# Altium schematic sheet Power.SchDoc
size A3; DocumentNumber: 4; SheetNumber: 4
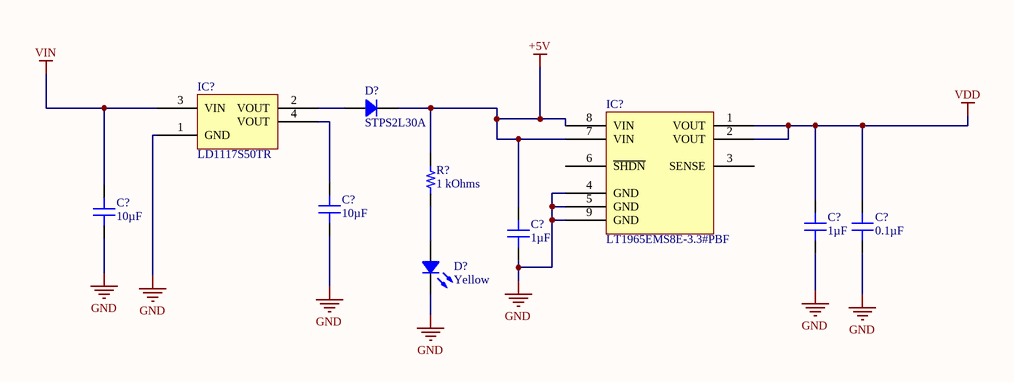
[diagram p0: Power.SchDoc]

## Parts
(Parts that share a designator on the sheet are numbered #1, #2 ... from top to bottom, then left to right.)
C?#1  10µF  [CAP 0603_1608]
C?#2  10µF  [CAP 0603_1608]
C?#3  1µF  [CAP 0603_1608]
C?#4  0.1µF  [CAP 0805_2012]
C?#5  1µF  [CAP 0603_1608]
D?#1  STPS2L30A  [DO214AC SMA]
D?#2  Yellow  [LED 1206_3216 YELLOW]
IC?#1  LD1117S50TR  [ST SOT-223]
IC?#2  LT1965EMS8E-3.3#PBF  [LT MSOP-8 MS8E 3X3MM]
R?  1 kOhms  [RES 0603_1608]

## Nets
+5V: C?#5.1 D?#1.2 IC?#2.7(VIN) IC?#2.8(VIN) R?.2
GND: C?#1.1 C?#2.1 C?#3.2 C?#4.2 C?#5.2 D?#2.2 IC?#1.1(GND) IC?#2.4(GND) IC?#2.5(GND) IC?#2.9(GND)
VDD: C?#3.1 C?#4.1 IC?#2.1(VOUT) IC?#2.2(VOUT)
VIN: C?#2.2 IC?#1.3(VIN)
NetC?#1_2: C?#1.2 IC?#1.4(VOUT)
NetD?#1_1: D?#1.1 IC?#1.2(VOUT)
NetD?#2_1: D?#2.1 R?.1

Not connected (* = marked no-connect by the designer): IC?#2 3(SENSE) 6(~{SHDN})

## Library data of the parts
C?#1 C?#2 = GRM188R61E106MA73D: CAP CER 10UF 25V X5R 0603; Manufacturer: Murata Electronics; Tolerance: ±20%; Part Number: GRM188R61E106MA73D; Value: 10µF; Applications: General Purpose; Capacitance: 10µF; ComponentLink1Description: Datasheet; ComponentLink1URL: https://www.murata.com/~/media/webrenewal/support/library/catalog/products/capacitor/mlcc/c02e.ashx?la=en-us; ComponentLink2Description: DigiKey Link; ComponentLink2URL: http://digikey.com/product-detail/en/murata-electronics/GRM188R61E106MA73D/490-7202-1-ND/3900486; Device Package: 0603 (1608 Metric); LastUpdated: 02/09/2020 01:03:25; Lifecycle Status: Active; Minimum Order: 1; Mounting Type: Surface Mount, MLCC; Operating Temperature: -55°C ~ 85°C; Package / Case: 0603 (1608 Metric); Packaging: TapeAndReel; PartId: 8314; Part Status: Active; Price: 0.09; Series: GRM; Size / Dimension: 0.063" L x 0.031" W (1.60mm x 0.80mm); Supplier 1: DigiKey; Supplier Part Number 1: 490-7202-1-ND; Temperature Coefficient: X5R; Thickness (Max): 0.031" (0.80mm); Voltage - Rated: 25V
C?#3 C?#5 = C0603C105K8PACTU: CAP CER 1UF 10V X5R 0603; Manufacturer: KEMET; Tolerance: ±10%; Part Number: C0603C105K8PACTU; Value: 1µF; Applications: General Purpose; Capacitance: 1µF; ComponentLink1Description: Datasheet; ComponentLink1URL: https://api.kemet.com/component-edge/download/datasheet/C0603C105K8PACTU.pdf; ComponentLink2Description: DigiKey Link; ComponentLink2URL: http://digikey.com/product-detail/en/kemet/C0603C105K8PACTU/399-3118-1-ND/551623; Device Package: 0603 (1608 Metric); LastUpdated: 02/09/2020 01:03:23; Lifecycle Status: Active; Minimum Order: 1; Mounting Type: Surface Mount, MLCC; Operating Temperature: -55°C ~ 85°C; Package / Case: 0603 (1608 Metric); Packaging: TapeAndReel; PartId: 9480; Part Status: Active; Price: 0.01; Series: SMD Comm X5R; Size / Dimension: 0.063" L x 0.031" W (1.60mm x 0.80mm); Supplier 1: DigiKey; Supplier Part Number 1: 399-3118-1-ND; Temperature Coefficient: X5R; Thickness (Max): 0.035" (0.90mm); Voltage - Rated: 10V
C?#4 = AC0805KKX8R9BB104: CAP CER 0805 10% X8R 50V 100NF; Manufacturer: Yageo; Part Number: AC0805KKX8R9BB104; Value: 0.1µF; Applications: Automotive; Capacitance: 0.1µF; ComponentLink1Description: Datasheet; ComponentLink1URL: http://www.yageo.com/documents/recent/AC0805KKX8R9BB104.pdf; ComponentLink2Description: DigiKey Link; ComponentLink2URL: http://digikey.com/product-detail/en/yageo/AC0805KKX8R9BB104/311-4624-1-ND/9699550; Device Package: 0805 (2012 Metric); LastUpdated: 02/09/2020 01:04:20; Lifecycle Status: Active; Minimum Order: 1; Mounting Type: Surface Mount, MLCC; Operating Temperature: -55°C ~ 150°C; Package / Case: 0805 (2012 Metric); Packaging: TapeAndReel; PartId: 14076; Part Status: Active; Price: 0.06; Ratings: AEC-Q200; Series: AC; Size / Dimension: 0.079" L x 0.049" W (2.00mm x 1.25mm); Supplier 1: DigiKey; Supplier Part Number 1: 311-4624-1-ND; Temperature Coefficient: X8R; Thickness (Max): 0.057" (1.45mm); Tolerance: ±10%; Voltage - Rated: 50V
D?#1 = STPS2L30A: DIODE SCHOTTKY 30V 2A SMA; Manufacturer: STMicroelectronics; Current - Reverse Leakage @ Vr: 200µA @ 30V; Speed: Fast Recovery =< 500ns, > 200mA (Io); Voltage - Forward (Vf) (Max) @ If: 450mV @ 2A; Part Number: STPS2L30A; ComponentLink1Description: Datasheet; ComponentLink1URL: http://www.st.com/content/ccc/resource/technical/document/datasheet/62/6b/2e/7f/34/cb/43/55/CD00001633.pdf/files/CD00001633.pdf/jcr:content/translations/en.CD00001633.pdf; ComponentLink2Description: DigiKey Link; ComponentLink2URL: http://digikey.com/product-detail/en/stmicroelectronics/STPS2L30A/497-3759-1-ND/691929; Current - Average Rectified (Io): 2A; Diode Type: Schottky; LastUpdated: 02/09/2020 01:19:04; Lifecycle Status: Active; Minimum Order: 1; Mounting Type: Surface Mount; Operating Temperature - Junction: 150°C (Max); Package / Case: DO-214AC, SMA; Packaging: TapeAndReel; PartId: 1916; Part Status: Active; Price: 0.07; Series: -; Supplier 1: DigiKey; Supplier Part Number 1: 497-3759-1-ND; Supplier Device Package: SMA; Voltage - DC Reverse (Vr) (Max): 30V
D?#2 = 5990240007F: LED YELLOW 1206 SMD; Manufacturer: Dialight; Configuration: Standard; Current - Test: 20mA; Lens Color: 0.80mm; Lens Size: 2.00mm x 1.60mm; Lens Style: Rectangle with Flat Top; Millicandela Rating: 126mcd; Viewing Angle: 140°; Voltage - Forward (Vf) (Typ): 2.1V; Wavelength - Dominant: 590nm; Part Number: 5990240007F; Color: Yellow; ComponentLink1Description: Datasheet; ComponentLink1URL: http://www.dialightsignalsandcomponents.com/Assets/Brochures_And_Catalogs/Indication/CBI_SMD_new/Dialight_CBI_data_599-1206_Apr2018.pdf; ComponentLink2Description: DigiKey Link; ComponentLink2URL: http://digikey.com/product-detail/en/dialight/5990240007F/350-4363-1-ND/9385469; Device Package: 1206 (3216 Metric); Height (Max): 0.80mm; LastUpdated: 02/09/2020 01:21:26; Lifecycle Status: Active; Minimum Order: 1; Mounting Type: Surface Mount; Package / Case: 1206 (3216 Metric); Packaging: TapeAndReel; PartId: 1; Part Status: Active; Price: 0.07; Series: 599; Size / Dimension: 3.20mm L x 1.60mm W; Supplier 1: DigiKey; Supplier Part Number 1: 350-4363-1-ND; Supplier Device Package: 1206; Value: Yellow
IC?#1 = LD1117S50TR: IC REG LINEAR 5V 800MA SOT223; Manufacturer: STMicroelectronics; Current - Quiescent (Iq): 10mA; Number of Regulators: 1; Output Configuration: Positive; Output Type: Fixed; Protection Features: Over Current, Over Temperature; PSRR: 75dB (120Hz); Voltage Dropout (Max): 1.2V @ 800mA; Voltage - Input (Max): 15V; Part Number: LD1117S50TR; ComponentLink1Description: Datasheet; ComponentLink1URL: http://www.st.com/content/ccc/resource/technical/document/datasheet/99/3b/7d/91/91/51/4b/be/CD00000544.pdf/files/CD00000544.pdf/jcr:content/translations/en.CD00000544.pdf; ComponentLink2Description: DigiKey Link; ComponentLink2URL: http://digikey.com/product-detail/en/stmicroelectronics/LD1117S50TR/497-6447-1-ND/1865475; Current - Output: 800mA; LastUpdated: 02/09/2020 01:24:39; Lifecycle Status: Active; Minimum Order: 1; Mounting Type: Surface Mount; Package / Case: TO-261-4, TO-261AA; Packaging: TapeAndReel; Part Status: Active; Price: 0.14; Series: -; Supplier 1: DigiKey; Supplier Part Number 1: 497-6447-1-ND; Supplier Device Package: SOT-223; Voltage - Output (Min/Fixed): 5V
IC?#2 = LT1965EMS8E-3.3#PBF: IC REG LINEAR 3.3V 1.1A 8MSOP; Manufacturer: Linear Technology/Analog Devices; Control Features: Enable; Current - Quiescent (Iq): 1.1mA; Current - Supply (Max): 40mA; Number of Regulators: 1; Output Configuration: Positive; Output Type: Fixed; Protection Features: Over Current, Over Temperature, Reverse Polarity; PSRR: 75dB (120Hz); Voltage Dropout (Max): 0.49V @ 1.1A; Voltage - Input (Max): 20V; Part Number: LT1965EMS8E-3.3#PBF; ComponentLink1Description: Datasheet; ComponentLink1URL: http://www.linear.com/docs/25320; ComponentLink2Description: DigiKey Link; ComponentLink2URL: http://digikey.com/product-detail/en/linear-technology-analog-devices/LT1965EMS8E-3.3-PBF/LT1965EMS8E-3.3-PBF-ND/2074395; Current - Output: 1.1A; LastUpdated: 02/09/2020 01:24:49; Lifecycle Status: Active; Minimum Order: 1; Mounting Type: Surface Mount; Operating Temperature: -40°C ~ 125°C; Package / Case: 8-TSSOP, 8-MSOP (0.118", 3.00mm Width) Exposed Pad; Packaging: Tube; Part Status: Active; Price: 4.83; Series: -; Supplier 1: DigiKey; Supplier Part Number 1: LT1965EMS8E-3.3#PBF-ND; Supplier Device Package: 8-MSOP-EP; Voltage - Output (Min/Fixed): 3.3V
R? = RT0603FRE071KL: RES SMD 1K OHM 1% 1/10W 0603; Manufacturer: Yageo; Power (Watts): 0.1W, 1/10W; Temperature Coefficient: ±50ppm/°C; Part Number: RT0603FRE071KL; Value: 1 kOhms; ComponentLink1Description: Datasheet; ComponentLink1URL: https://www.yageo.com/upload/media/product/productsearch/datasheet/rchip/PYu-RT_1-to-0.01_RoHS_L_11.pdf; ComponentLink2Description: DigiKey Link; ComponentLink2URL: http://digikey.com/product-detail/en/yageo/RT0603FRE071KL/YAG2323CT-ND/5252437; Composition: Thin Film; Device Package: 0603 (1608 Metric); Height - Seated (Max): 0.022" (0.55mm); LastUpdated: 02/09/2020 01:10:23; Lifecycle Status: Active; Minimum Order: 1; Number of Terminations: 2; Operating Temperature: -55°C ~ 155°C; Package / Case: 0603 (1608 Metric); Packaging: TapeAndReel; PartId: 5672; Part Status: Active; Price: 0.01; Resistance: 1 kOhms; Series: RT; Size / Dimension: 0.063" L x 0.031" W (1.60mm x 0.80mm); Supplier 1: DigiKey; Supplier Part Number 1: YAG2323CT-ND; Supplier Device Package: 0603; Tolerance: ±1%